# Altium project led_RGB_esp32.PrjPcb
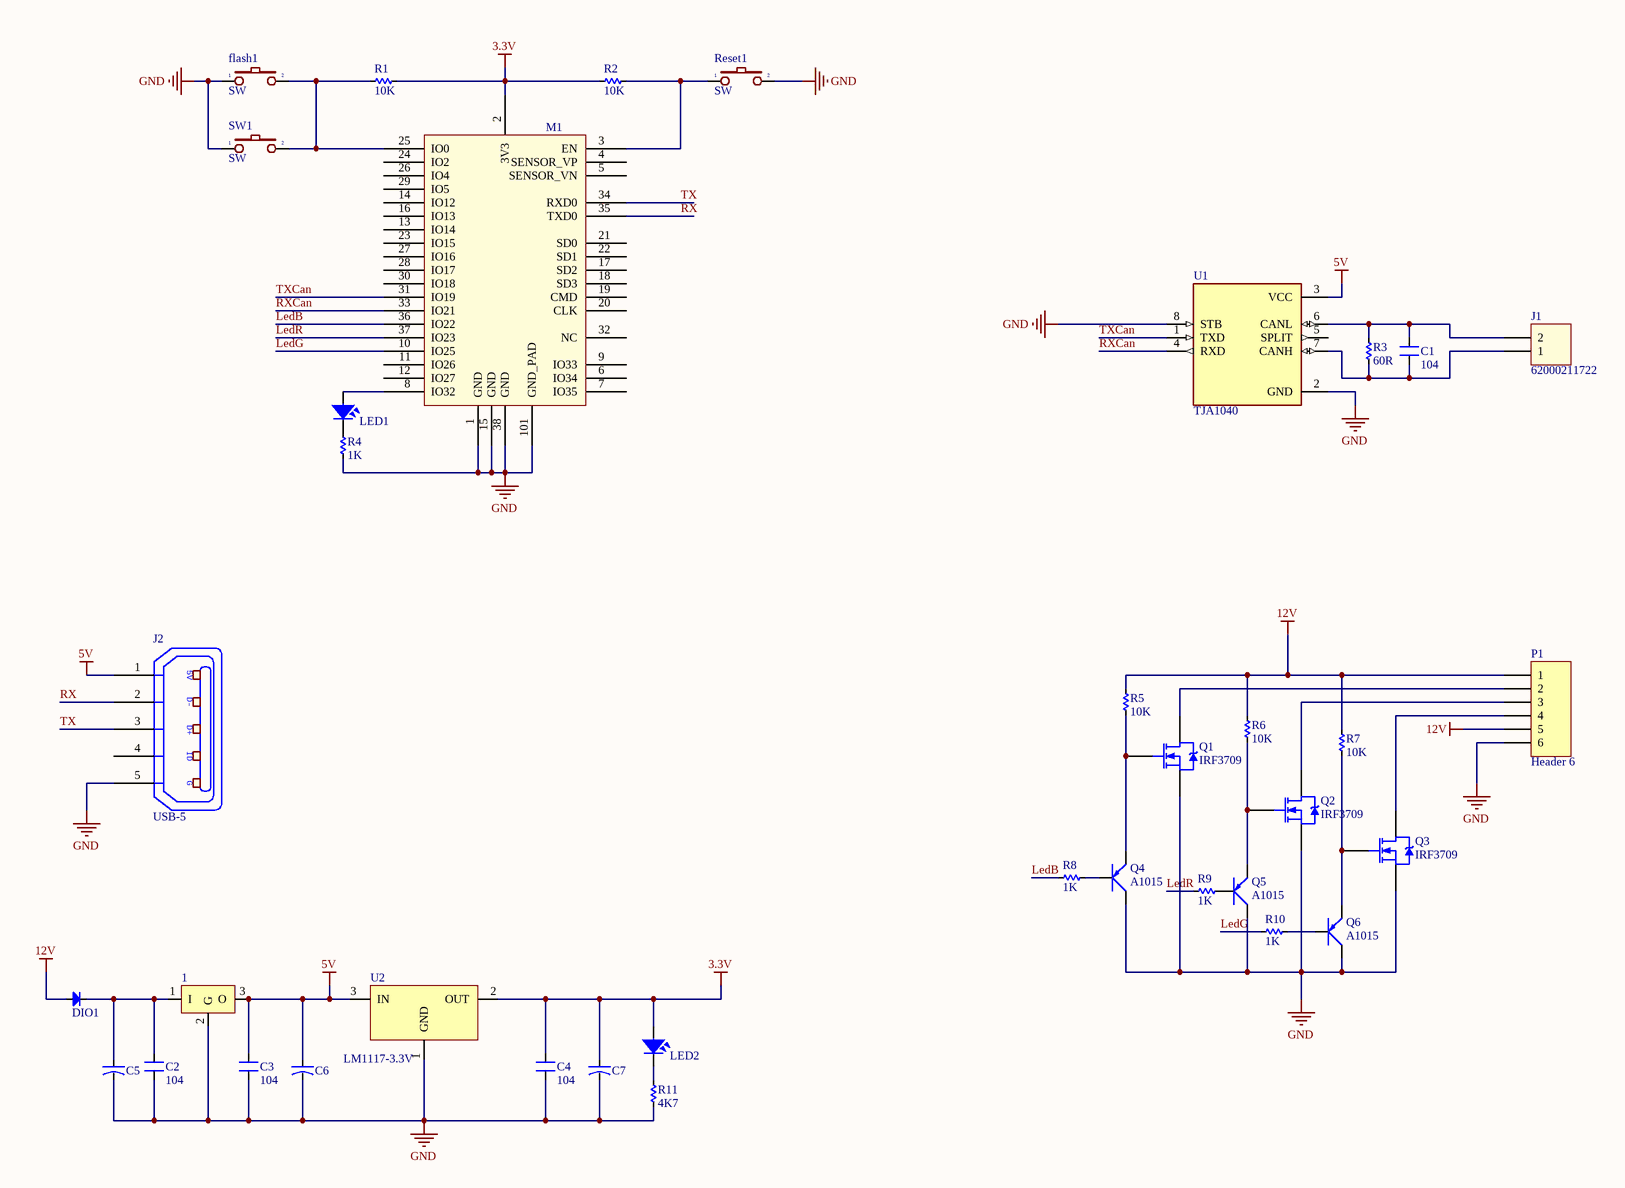
[diagram p0: led_RGB_esp32_schematic.SchDoc]
1 sheet, 37 parts. Net scope: global (net labels, ports and power ports of the same name join across sheets).
Board file: led_RGB_esp32_pcb.PcbDoc

## Sheet led_RGB_esp32_schematic.SchDoc
size A3

### Parts
1  LM78xx  [TO252-123]  (value not drawn)
C1  104  [SM-CAP-0805]
C2  104  [SM-CAP-0805]
C3  104  [SM-CAP-0805]
C4  104  [SM-CAP-0805]
C5  CN-ALU-SMD  [CAP-ALU-SMD-4.5x5x1.4]  (value not drawn)
C6  CN-ALU-SMD  [CAP-ALU-SMD-4.5x5x1.4]  (value not drawn)
C7  CN-ALU-SMD  [CAP-ALU-SMD-4.5x5x1.4]  (value not drawn)
DIO1  Diode SMD  [DIO-SMD-106]  (value not drawn)
flash1  SW  [SW-DIP1-1]
J1  62000211722  [62000211722]
J2  USB-5  [USB-M1]
LED1  LED  [LED-0805-Blue]  (value not drawn)
LED2  LED  [LED-0805-Blue]  (value not drawn)
M1  ESP32S_Module  [ESP32S]  (value not drawn)
P1  Header 6  [HED6T]
Q1  IRF3709  [D2PAK_N]
Q2  IRF3709  [D2PAK_N]
Q3  IRF3709  [D2PAK_N]
Q4  A1015  [SOT23B]
Q5  A1015  [SOT23B]
Q6  A1015  [SOT23B]
R1  10K  [RES-SMD-0805]
R2  10K  [RES-SMD-0805]
R3  60R  [RES-SMD-0805]
R4  1K  [RES-SMD-0805]
R5  10K  [RES-SMD-0805]
R6  10K  [RES-SMD-0805]
R7  10K  [RES-SMD-0805]
R8  1K  [RES-SMD-0805]
R9  1K  [RES-SMD-0805]
R10  1K  [RES-SMD-0805]
R11  4K7  [RES-SMD-0805]
Reset1  SW  [SW1-SMD]
SW1  SW  [SW2-D2]
U1  TJA1040  [SOIC127P600X175-8N]
U2  LM1117-3.3V  [SOT223]

### Nets
3.3V: C4.2 C7.1 LED2.1 M1.2(3V3) R1.2 R2.1 U2.2(OUT)
5V: 1.3(O) C3.2 C6.1 J2.1(P1) U1.3(VCC) U2.3(IN)
12V: DIO1.1(A) P1.1 P1.5 R5.1 R6.1 R7.1
GND: 1.2(G) C2.1 C3.1 C4.1 C5.2 C6.2 C7.2 flash1.1 J2.5(P5) M1.1(GND) M1.15(GND) M1.38(GND) M1.101(GND_PAD) P1.6 Q1.3(S) Q2.3(S) Q3.3(S) Q4.2(C) Q5.2(C) Q6.2(C) R4.1 R11.2 Reset1.2 SW1.1 U1.2(GND) U1.8(STB) U2.1(GND)
LedB: M1.36(IO22) R8.1
LedG: M1.10(IO25) R10.1
LedR: M1.37(IO23) R9.1
RX: J2.2(P2) M1.35(TXD0)
RXCan: M1.33(IO21) U1.4(RXD)
TX: J2.3(P3) M1.34(RXD0)
TXCan: M1.31(IO19) U1.1(TXD)
Net1_1: 1.1(I) C2.2 C5.1 DIO1.2(K)
NetC1_1: C1.1 J1.1 R3.1 U1.7(CANH)
NetC1_2: C1.2 J1.2 R3.2 U1.6(CANL)
Netflash1_2: flash1.2 M1.25(IO0) R1.1 SW1.2
NetLED1_1: LED1.1 M1.8(IO32)
NetLED1_2: LED1.2 R4.2
NetLED2_2: LED2.2 R11.1
NetM1_3: M1.3(EN) R2.2 Reset1.1
NetP1_2: P1.2 Q1.2(D)
NetP1_3: P1.3 Q2.2(D)
NetP1_4: P1.4 Q3.2(D)
NetQ1_1: Q1.1(G) Q4.1(E) R5.2
NetQ2_1: Q2.1(G) Q5.1(E) R6.2
NetQ3_1: Q3.1(G) Q6.1(E) R7.2
NetQ4_3: Q4.3(B) R8.2
NetQ5_3: Q5.3(B) R9.2
NetQ6_3: Q6.3(B) R10.2

Not connected (* = marked no-connect by the designer): J2 4(P4); M1 4(SENSOR_VP) 5(SENSOR_VN) 6(IO34) 7(IO35) 9(IO33) 11(IO26) 12(IO27) 13(IO14) 14(IO12) 16(IO13) 17(SD2) 18(SD3) 19(CMD) 20(CLK) 21(SD0) 22(SD1) 23(IO15) 24(IO2) 26(IO4) 27(IO16) 28(IO17) 29(IO5) 30(IO18) 32(NC); U1 5(SPLIT)

### Notes on the sheet
- (in symbol USB-5) 5V; D-; D+; ID; G

### Library data of the parts
1 = LM78xx: Positive Voltage Regulator; Note: Tab is connected to pin 3 (GND).; Published: 24-Aug-2001; LatestRevisionDate: 17-Jul-2002; LatestRevisionNote: Re-released for DXP Platform.; DatasheetVersion: Apr-1994; PackageVersion: Jul-1998; PackageReference: ISOWATT220AB; Publisher: Altium Limited; PackageDescription: TO, Thru-Hole, Vertical, Heatsink Mounted; 3 In-Line Leads; Pitch 2.54 mm; Pin sequence 1, 3, 2; ComponentLink1Description: Manufacturer Link; ComponentLink1URL: http://www.st.com/; ComponentLink2Description: Datasheet; ComponentLink2URL: http://www.st.com/stonline/products/literature/ds/2146/l78m05c.pdf
C1-C4 = CN: Value: 0,1uF/300V; Designed by: VanDungEvn
C5-C7 = CN-ALU-SMD: Polarized Capacitor (Axial); Published: 8-Jun-2000; LatestRevisionDate: 17-Jul-2002; LatestRevisionNote: Re-released for DXP Platform.; PackageReference: POLAR0.8; Publisher: Altium Limited
DIO1 = Diode SMD: Default Diode; Code - JEDEC: DO-214-AB; Value: 1N5007; Published: 8-Jun-2000; Revision: July-2002: Re-released for DXP Platform.; Publisher: Altium Limited
flash1 Reset1 SW1 = SW2: Switch button 2 pin; Value: SW chip 2 pin
J1 = 62000211722: WR-WTB 2.00mm Male Horizontal Shrouded Header, 2p; Pin Number: 2; ComponentLink1Description: Manufacturer; ComponentLink1URL: http://www.we-online.de; ComponentLink2Description: Datasheet; ComponentLink2URL: http://katalog.we-online.de/em/datasheet/6200xx11722.pdf; Part Number: 62000211722; Published Date: June 2017; Publisher: Wurth Elektronik; Pitch: 2.00 mm
J2 = USB-5: Manufacturer: FCI; Manufacturer Part Number: 10118193-0001LF; Connector Type: USB - micro B; Number of Contacts: 5; Gender: Receptacle; Specifications: USB 2.0; .Creator: MM; .Checked PCB: RF; Supplier 1: Digi-Key; RoHS: RoHS Compliant; Category: Connectors, Interconnects; Stock 1: 28642; Pricing 1: 1=0.46, 10=0.433, 25=0.3712, 50=0.3156, 100=0.3032, 250=0.27224, 500=0.25988 (USD); Packaging: Cut Tape (CT); Mounting Type: Surface Mount, Right Angle, Horizontal; Features: Shielded, Solder Retention; Ingress Protection: -; ComponentLink1URL: http://portal.fciconnect.com/Comergent//fci/drawing/10118193.pdf; ComponentLink1Description: http://portal.fciconnect.com/Comergent//fci/drawing/10118193.pdf; Supplier Part Number 1: 609-4616-1-ND; .Checked SCH: MM
LED1 LED2 = LED SMD: Value: LED 3 - 5 ly 2 Colour
M1 = ESP32S_Module: Esp-32S; Datasheet: https://espressif.com/sites/default/files/documentation/esp_wroom_32_datasheet_en.pdf
P1 = Header 6: Header, 6-Pin; LatestRevisionDate: 17-Jul-2002; LatestRevisionNote: Re-released for DXP Platform.; Publisher: Altium Limited
Q1-Q3 = IRF540S: HEXFET N-Channel Power MOSFET; Published: 8-Jun-2000; LatestRevisionDate: 20-Nov-2009; LatestRevisionNote: IPC-7351 Footprint Added.; DatasheetVersion: PD-9.898; PackageReference: D2PAK; Publisher: Altium Limited; PackageDescription: 3-Pin Transistor Outline Package 2.54 mm Pitch, 15.1 mm Lead Span; ComponentLink1Description: Manufacturer Link; ComponentLink1URL: http://www.irf.com/; ComponentLink2Description: Datasheet; ComponentLink2URL: http://www.irf.com/product-info/datasheets/data/irf540s.pdf
Q4-Q6 = A1015: PNP 600mW, ECB; Value: A1015
R1-R11 = Res-SMD: Resistor; Manufacturer: Generic Components; Class: Passive; Published: 08/06/2000; Publisher: Altium Hobart Technology Centre
U1 = TJA1040: 1/1 Transceiver Half CANbus 8-SO; MF: NXP USA; Package: SOIC-8 NXP USA; SnapEDA_Link: https://www.snapeda.com/parts/TJA1040/NXP%20USA%20Inc./view-part/563351/?ref=snap; Price: None; Availability: Unavailable; MP: TJA1040; Value: *
U2 = LM1117: 800mA Low-Dropout Linear Regulator; Creator: Nguyen Ba Bien; Website: http://group3i.net